# Altium schematic sheet TopSheet.SchDoc: ZoZbot Lower Main Board - TopSheet
size B; Author: RMG; Organization: OLogic, Inc.; DocumentNumber: LMB1; Revision: C; SheetNumber: 1; SheetTotal: 10; PageSetup: Record=PageOptions|CenterHorizontal=True|CenterVertical=True|PrintScale=0.70|XCorrection=1.00|YCorrection=1.00|PrintKind=0|BorderSize=5000000|LeftOffset=0|BottomOffset=0|Orientation=2|PaperLength=1000|PaperWidth=1000|Scale=100|PaperSource=15|PrintQuality=600|MediaType=1|DitherType=10|PrintScaleMode=1|PaperKind=Letter|PaperIndex=1
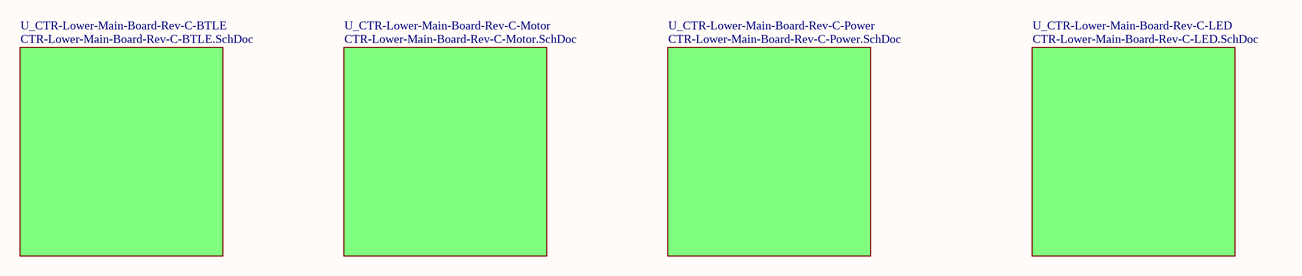
[diagram p0: TopSheet.SchDoc]

## Sub-sheets
U_CTR-Lower-Main-Board-Rev-C-BTLE = CTR-Lower-Main-Board-Rev-C-BTLE.SchDoc: no entries
U_CTR-Lower-Main-Board-Rev-C-LED = CTR-Lower-Main-Board-Rev-C-LED.SchDoc: no entries
U_CTR-Lower-Main-Board-Rev-C-Motor = CTR-Lower-Main-Board-Rev-C-Motor.SchDoc: no entries
U_CTR-Lower-Main-Board-Rev-C-Power = CTR-Lower-Main-Board-Rev-C-Power.SchDoc: no entries

## Notes on the sheet
- Title
- By:
- Date:
- Number:
- Time:
- Revision:
- Sheet
- of
- OLogic, Inc.
- 1394 Borregas Ave.
- Sunnyvale, CA
- 94089 USA
- File:
- (650) 996-1490